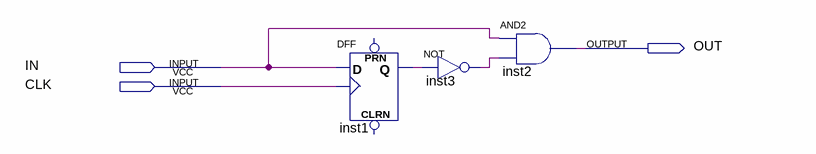
[diagram p0: schematic sheet]
// Quartus schematic InstantRisingEdge.bdf as structural Verilog: 3 symbols, 3 pins
module InstantRisingEdge (
  input  IN,
  input  CLK,
  output OUT
);

  wire inst1_q, inst3_out;

  DFF inst1 (.CLK(CLK), .D(IN), .Q(inst1_q));  // open: CLRN, PRN
  not inst3 (inst3_out, inst1_q);
  and inst2 (OUT, IN, inst3_out);
endmodule
